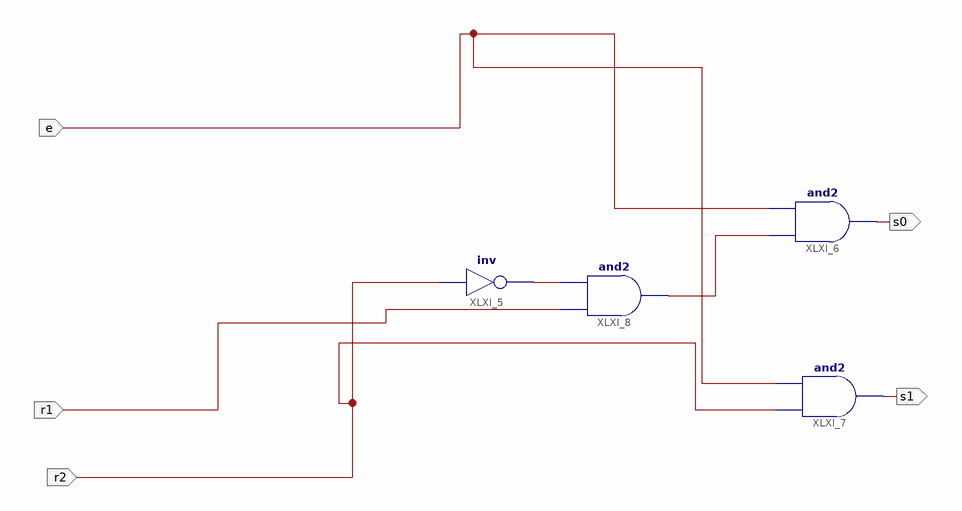
[diagram p0: schematic sheet 1]
// Xilinx ISE schematic penc.sch (artix7) as structural Verilog: 4 symbols, 5 ports
module penc (
  input  r2,
  input  e,
  input  r1,
  output s0,
  output s1
);

  wire XLXN_4, XLXN_5;

  not XLXI_5 (XLXN_4, r2);
  and XLXI_6 (s0, XLXN_5, e);
  and XLXI_7 (s1, r2, e);
  and XLXI_8 (XLXN_5, r1, XLXN_4);
endmodule
